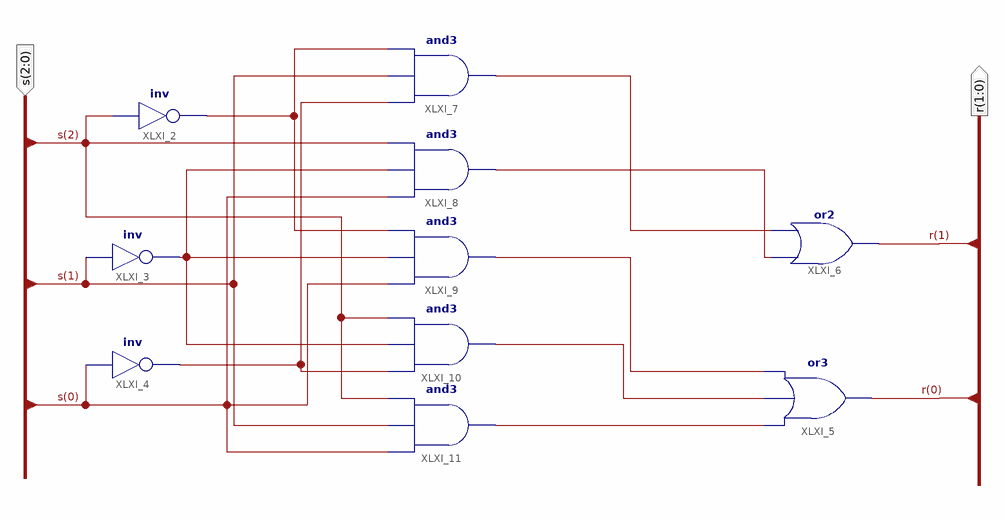
[diagram p0: schematic sheet 1]
// Xilinx ISE schematic residue_generator_mod3_3bit.sch (spartan3e) as structural Verilog: 10 symbols, 2 ports
module residue_generator_mod3_3bit (
  input  [2:0] s,
  output [1:0] r
);

  wire XLXN_43, XLXN_44, XLXN_45, XLXN_47, XLXN_49, XLXN_52, XLXN_58, XLXN_59;

  not XLXI_4 (XLXN_44, s[0]);
  not XLXI_3 (XLXN_47, s[1]);
  not XLXI_2 (XLXN_43, s[2]);
  or XLXI_5 (r[0], XLXN_59, XLXN_58, XLXN_52);
  or XLXI_6 (r[1], XLXN_49, XLXN_45);
  and XLXI_7 (XLXN_45, XLXN_44, s[1], XLXN_43);
  and XLXI_8 (XLXN_49, s[0], XLXN_47, s[2]);
  and XLXI_9 (XLXN_52, s[0], XLXN_47, XLXN_43);
  and XLXI_10 (XLXN_58, XLXN_44, XLXN_47, s[2]);
  and XLXI_11 (XLXN_59, s[0], s[1], s[2]);
endmodule
